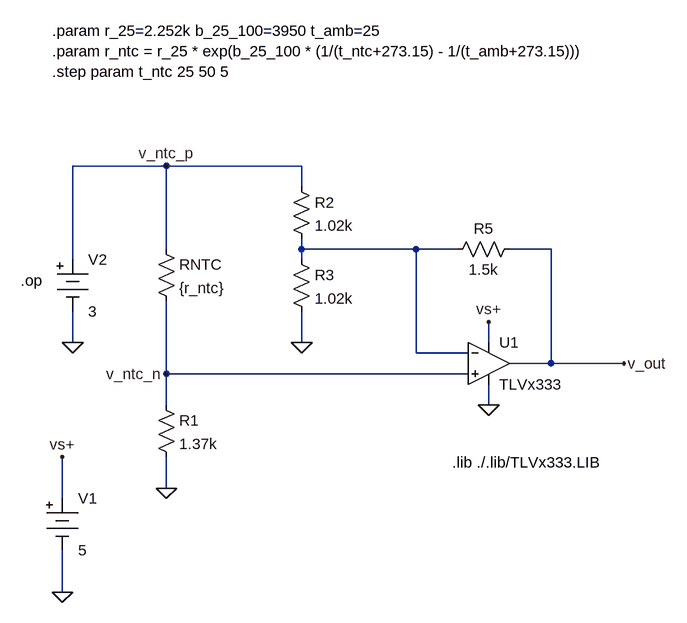
[diagram p0: schematic thermal.asc]
thermal.asc, the LTspice schematic file:
Version 4.1
SHEET 1 880 680
WIRE -576 -336 -720 -336
WIRE -368 -336 -576 -336
WIRE -368 -304 -368 -336
WIRE -576 -208 -576 -336
WIRE -368 -208 -368 -224
WIRE -192 -208 -368 -208
WIRE -128 -208 -192 -208
WIRE 16 -208 -48 -208
WIRE -720 -192 -720 -336
WIRE -368 -192 -368 -208
WIRE -720 -64 -720 -112
WIRE -368 -64 -368 -112
WIRE -80 -64 -80 -96
WIRE -192 -48 -192 -208
WIRE -112 -48 -192 -48
WIRE 16 -32 16 -208
WIRE 16 -32 -48 -32
WIRE 128 -32 16 -32
WIRE -576 -16 -576 -128
WIRE -112 -16 -576 -16
WIRE -576 32 -576 -16
WIRE -80 32 -80 0
WIRE -576 160 -576 112
WIRE -736 176 -736 112
WIRE -736 320 -736 256
FLAG -80 -96 vs+
FLAG -80 32 0
FLAG -736 320 0
FLAG -736 112 vs+
FLAG -720 -64 0
FLAG -368 -64 0
FLAG -576 160 0
FLAG -576 -336 v_ntc_p
FLAG -576 -16 v_ntc_n
FLAG 128 -32 v_out
SYMBOL OpAmps\\opamp2 -80 -96 R0
SYMATTR InstName U1
SYMATTR Value TLVx333
SYMBOL res -32 -224 R90
WINDOW 0 0 56 VBottom 2
WINDOW 3 32 56 VTop 2
SYMATTR InstName R5
SYMATTR Value 1.5k
SYMBOL Misc\\battery -736 160 R0
WINDOW 123 0 0 Left 0
WINDOW 39 0 0 Left 0
SYMATTR InstName V1
SYMATTR Value 5
SYMBOL Misc\\battery -720 -208 R0
SYMATTR InstName V2
SYMATTR Value 3
SYMBOL res -592 -224 R0
SYMATTR InstName RNTC
SYMATTR Value {r_ntc}
SYMBOL res -592 16 R0
SYMATTR InstName R1
SYMATTR Value 1.37k
SYMBOL res -384 -320 R0
SYMATTR InstName R2
SYMATTR Value 1.02k
SYMBOL res -384 -208 R0
SYMATTR InstName R3
SYMATTR Value 1.02k
TEXT -800 -160 Left 2 !.op
TEXT -752 -544 Left 2 !.param r_25=2.252k b_25_100=3950 t_amb=25\n.param r_ntc = r_25 * exp(b_25_100 * (1/(t_ntc+273.15) - 1/(t_amb+273.15)))\n.step param t_ntc 25 50 5
TEXT -136 120 Left 2 !.lib ./.lib/TLVx333.LIB

The netlist it stands for:
* thermal.asc
X§U1 v_ntc_n N001 vs+ 0 v_out TLVx333  ; pins In+ In- V+ V- OUT
R5 v_out N001 1.5k
V1 vs+ 0 5
V2 v_ntc_p 0 3
RNTC v_ntc_p v_ntc_n {r_ntc}
R1 v_ntc_n 0 1.37k
R2 v_ntc_p N001 1.02k
R3 N001 0 1.02k
.op
.param r_25=2.252k b_25_100=3950 t_amb=25
.param r_ntc = r_25 * exp(b_25_100 * (1/(t_ntc+273.15) - 1/(t_amb+273.15)))
.step param t_ntc 25 50 5
.lib ./.lib/TLVx333.LIB
.backanno
.end